# Altium schematic sheet S03.SchDoc: DQLA-Q  Dual QLA Interface Board
size 381 x 254 mm; Revision: 1.1; SheetNumber: 3; SheetTotal: 3
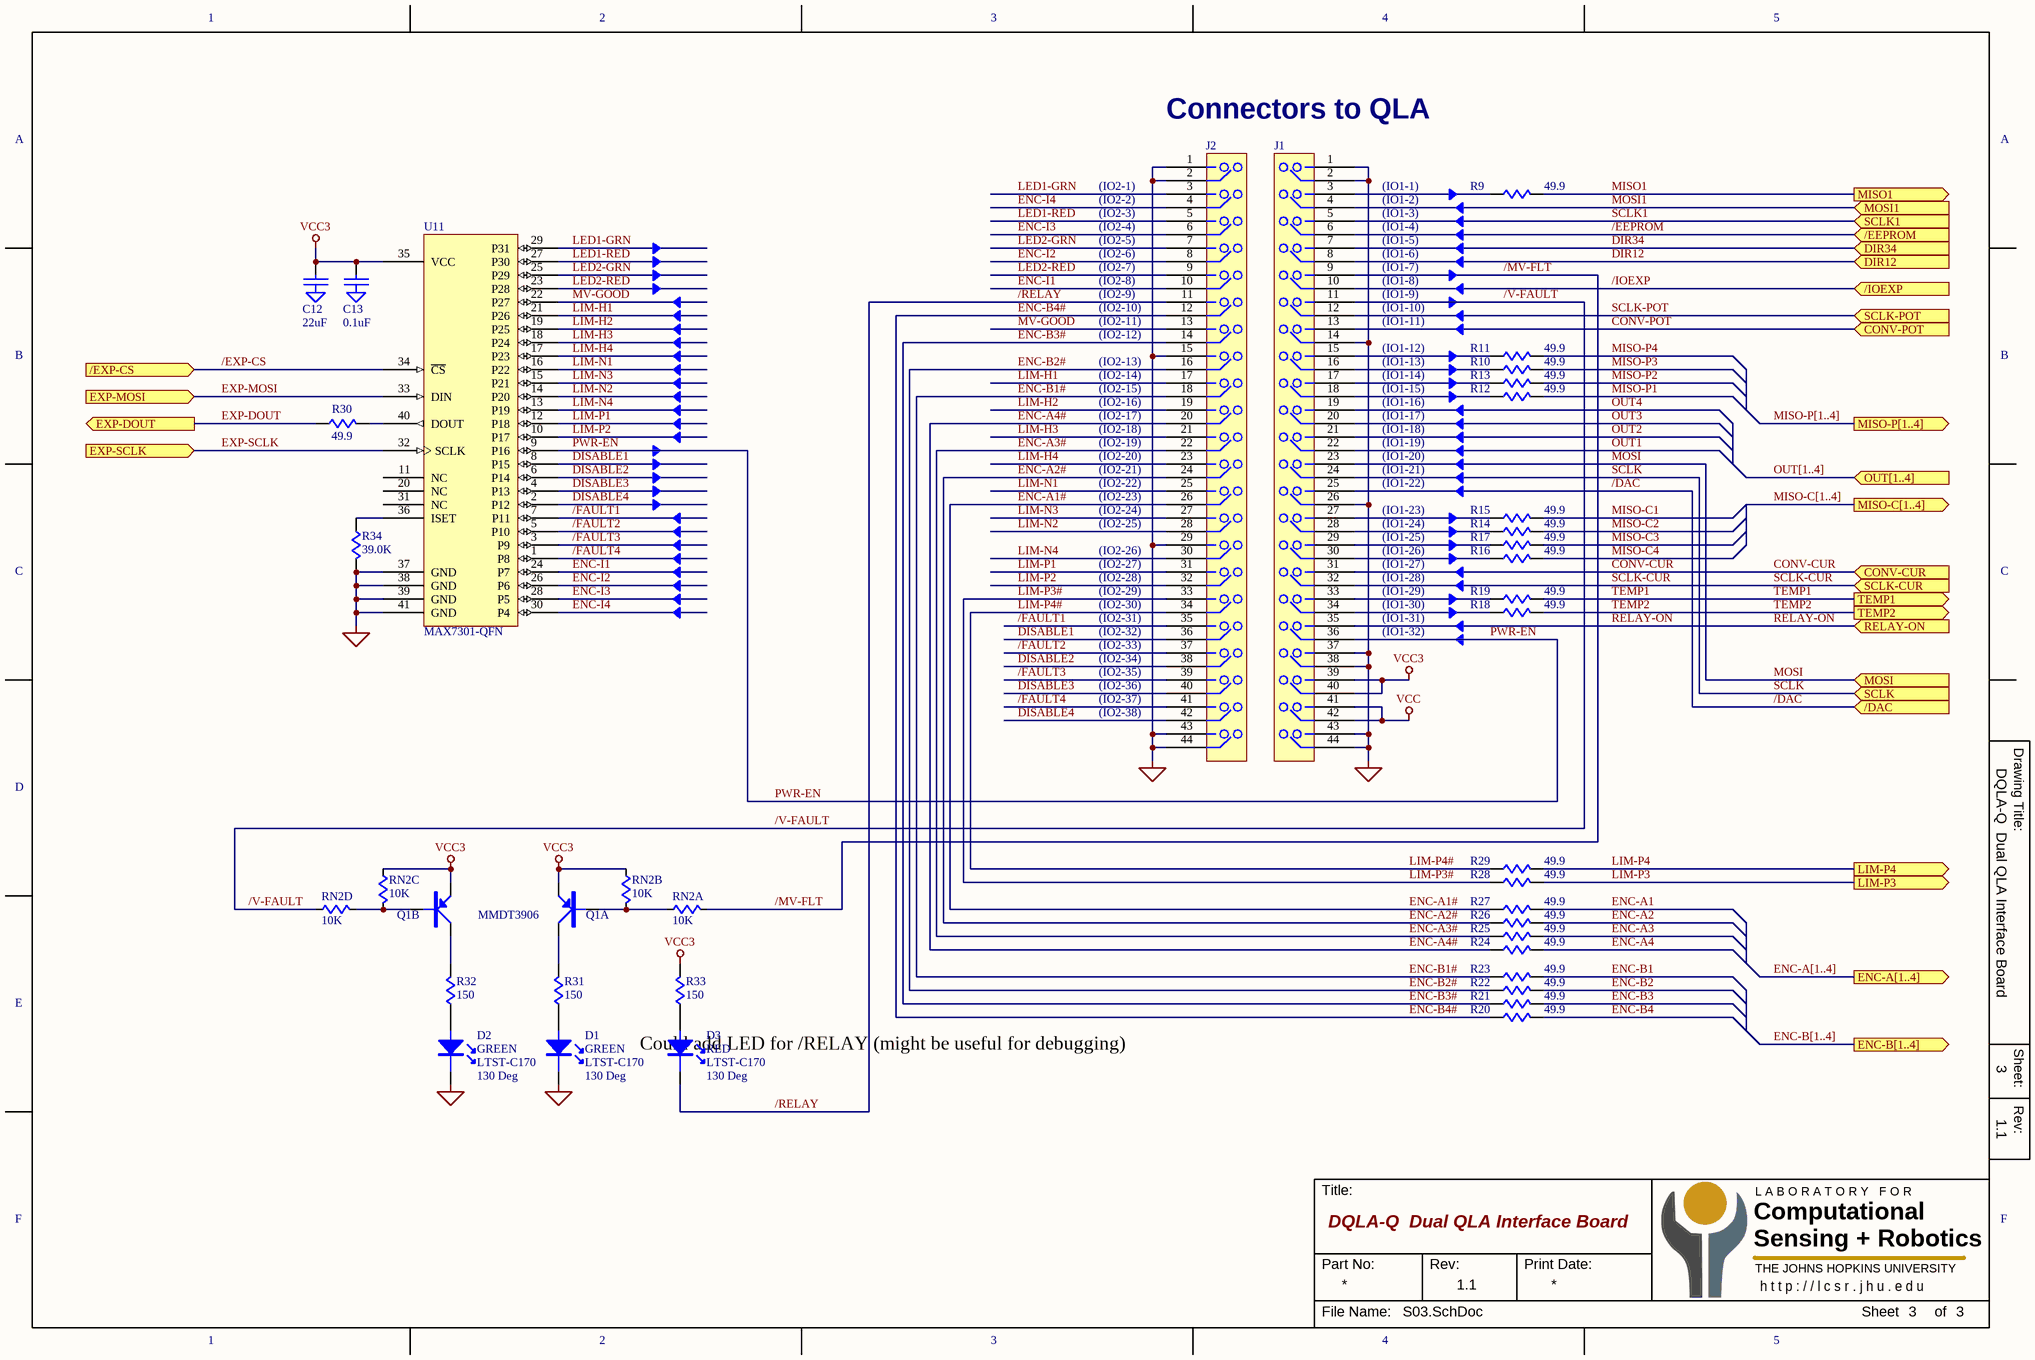
[diagram p0: S03.SchDoc]

## Parts
C12  22uF  [C0805]
C13  0.1uF  [C0402]
D1  Color: GREEN  P/N: LTST-C170  Angle: 130 Deg  [LED-0805]  (hidden comment: LED)
D2  Color: GREEN  P/N: LTST-C170  Angle: 130 Deg  [LED-0805]  (hidden comment: LED)
D3  Color: RED  P/N: LTST-C170  Angle: 130 Deg  [LED-0805]  (hidden comment: LED)
J1  HEADER 22x2-1  [HDR-22x2-2MM]  (value not drawn)
J2  HEADER 22x2-1  [HDR-22x2-2MM]  (value not drawn)
Q1  MMDT3906  [SC70-6-NP]  (parts A,B of 2)
R9  49.9  [R0402]
R10  49.9  [R0402]
R11  49.9  [R0402]
R12  49.9  [R0402]
R13  49.9  [R0402]
R14  49.9  [R0402]
R15  49.9  [R0402]
R16  49.9  [R0402]
R17  49.9  [R0402]
R18  49.9  [R0402]
R19  49.9  [R0402]
R20  49.9  [R0402]
R21  49.9  [R0402]
R22  49.9  [R0402]
R23  49.9  [R0402]
R24  49.9  [R0402]
R25  49.9  [R0402]
R26  49.9  [R0402]
R27  49.9  [R0402]
R28  49.9  [R0402]
R29  49.9  [R0402]
R30  49.9  [R0402]
R31  150  [R0603]
R32  150  [R0603]
R33  150  [R0603]
R34  39.0K  [R0402]
RN2  10K  [RN-742C083]  (parts A,B,C,D of 4)
U11  MAX7301-QFN  [QFN-40-6mm]

## Ports
/DAC (in), /EEPROM (in), /EXP-CS (in), /IOEXP (in), CONV-CUR (in), CONV-POT (in), DIR12 (in), DIR34 (in), ENC-A[1..4] (out), ENC-B[1..4] (out), EXP-DOUT (out), EXP-MOSI (in), EXP-SCLK (in), LIM-P3 (out), LIM-P4 (out), MISO1 (out), MISO-C[1..4] (out), MISO-P[1..4] (out), MOSI1 (in), MOSI (in), OUT[1..4] (in), RELAY-ON (in), SCLK1 (in), SCLK (in), SCLK-CUR (in), SCLK-POT (in), TEMP1 (out), TEMP2 (out)

## Nets
GND: C12.2(GND) C13.2(GND) D1.1(C) D2.1(C) J1.1 J1.2 J1.14 J1.26 J1.37 J1.38 J1.43 J1.44 J2.1 J2.2 J2.15 J2.29 J2.43 J2.44 R34.2 U11.37(GND) U11.38(GND) U11.39(GND) U11.41(GND)
VCC: J1.41 J1.42
VCC3: C12.1 C13.1 J1.39 J1.40 Q1.1(E) Q1.4(E) R33.2 RN2.2 RN2.3 U11.35(VCC)
/DAC: J1.25 ; port /DAC
/EEPROM: J1.6 ; port /EEPROM
/EXP-CS: U11.34(~{CS}) ; port /EXP-CS
/FAULT1: J2.35 U11.7(P11)
/FAULT2: J2.37 U11.5(P10)
/FAULT3: J2.39 U11.3(P9)
/FAULT4: J2.41 U11.1(P8)
/IOEXP: J1.10 ; port /IOEXP
/MV-FLT: J1.9 RN2.1
/RELAY: D3.1(C) J2.11
/V-FAULT: J1.11 RN2.4
CONV-CUR: J1.31 ; port CONV-CUR
CONV-POT: J1.13 ; port CONV-POT
DIR12: J1.8 ; port DIR12
DIR34: J1.7 ; port DIR34
DISABLE1: J2.36 U11.8(P15)
DISABLE2: J2.38 U11.6(P14)
DISABLE3: J2.40 U11.4(P13)
DISABLE4: J2.42 U11.2(P12)
ENC-A1: R27.2
ENC-A1#: J2.26 R27.1
ENC-A2: R26.2
ENC-A2#: J2.24 R26.1
ENC-A3: R25.2
ENC-A3#: J2.22 R25.1
ENC-A4: R24.2
ENC-A4#: J2.20 R24.1
ENC-B1: R23.2
ENC-B1#: J2.18 R23.1
ENC-B2: R22.2
ENC-B2#: J2.16 R22.1
ENC-B3: R21.2
ENC-B3#: J2.14 R21.1
ENC-B4: R20.2
ENC-B4#: J2.12 R20.1
ENC-I1: J2.10 U11.24(P7)
ENC-I2: J2.8 U11.26(P6)
ENC-I3: J2.6 U11.28(P5)
ENC-I4: J2.4 U11.30(P4)
EXP-DOUT: R30.1 ; port EXP-DOUT
EXP-MOSI: U11.33(DIN) ; port EXP-MOSI
EXP-SCLK: U11.32(SCLK) ; port EXP-SCLK
LED1-GRN: J2.3 U11.29(P31)
LED1-RED: J2.5 U11.27(P30)
LED2-GRN: J2.7 U11.25(P29)
LED2-RED: J2.9 U11.23(P28)
LIM-H1: J2.17 U11.21(P26)
LIM-H2: J2.19 U11.19(P25)
LIM-H3: J2.21 U11.18(P24)
LIM-H4: J2.23 U11.17(P23)
LIM-N1: J2.25 U11.16(P22)
LIM-N2: J2.28 U11.14(P20)
LIM-N3: J2.27 U11.15(P21)
LIM-N4: J2.30 U11.13(P19)
LIM-P1: J2.31 U11.12(P18)
LIM-P2: J2.32 U11.10(P17)
LIM-P3: R28.2 ; port LIM-P3
LIM-P3#: J2.33 R28.1
LIM-P4: R29.2 ; port LIM-P4
LIM-P4#: J2.34 R29.1
MISO1: R9.2 ; port MISO1
MISO-C1: R15.2
MISO-C2: R14.2
MISO-C3: R17.2
MISO-C4: R16.2
MISO-P1: R12.2
MISO-P2: R13.2
MISO-P3: R10.2
MISO-P4: R11.2
MOSI: J1.23 ; port MOSI
MOSI1: J1.4 ; port MOSI1
MV-GOOD: J2.13 U11.22(P27)
OUT1: J1.22
OUT2: J1.21
OUT3: J1.20
OUT4: J1.19
PWR-EN: J1.36 U11.9(P16)
RELAY-ON: J1.35 ; port RELAY-ON
SCLK: J1.24 ; port SCLK
SCLK1: J1.5 ; port SCLK1
SCLK-CUR: J1.32 ; port SCLK-CUR
SCLK-POT: J1.12 ; port SCLK-POT
TEMP1: R19.2 ; port TEMP1
TEMP2: R18.2 ; port TEMP2
NetD1_2: D1.2(A) R31.1
NetD2_2: D2.2(A) R32.1
NetD3_2: D3.2(A) R33.1
NetJ1_3: J1.3 R9.1
NetJ1_15: J1.15 R11.1
NetJ1_16: J1.16 R10.1
NetJ1_17: J1.17 R13.1
NetJ1_18: J1.18 R12.1
NetJ1_27: J1.27 R15.1
NetJ1_28: J1.28 R14.1
NetJ1_29: J1.29 R17.1
NetJ1_30: J1.30 R16.1
NetJ1_33: J1.33 R19.1
NetJ1_34: J1.34 R18.1
NetQ1_2: Q1.2(B) RN2.7 RN2.8
NetQ1_3: Q1.3(C) R32.2
NetQ1_5: Q1.5(B) RN2.5 RN2.6
NetQ1_6: Q1.6(C) R31.2
NetR30_2: R30.2 U11.40(DOUT)
NetR34_1: R34.1 U11.36(ISET)

Not connected (* = marked no-connect by the designer): U11 11(NC) 20(NC) 31(NC)

## Buses and harness runs
bus ENC-A[1..4] = port ENC-A[1..4]
bus ENC-B[1..4] = port ENC-B[1..4]
bus MISO-C[1..4] = port MISO-C[1..4]
bus MISO-P[1..4] = port MISO-P[1..4]
bus OUT[1..4] = port OUT[1..4]

## Notes on the sheet
- Connectors to QLA
- (IO2-1)
- (IO2-2)
- (IO2-3)
- (IO2-4)
- (IO1-1)
- (IO1-2)
- (IO1-3)
- (IO1-4)
- (IO2-5)
- (IO2-6)
- (IO2-7)
- (IO2-8)
- (IO2-9)
- (IO1-5)
- (IO1-6)
- (IO1-7)
- (IO1-8)
- (IO1-9)
- (IO2-10)
- (IO2-11)
- (IO2-12)
- (IO2-13)
- (IO1-10)
- (IO1-11)
- (IO1-12)
- (IO1-13)
- (IO2-14)
- (IO2-15)
- (IO2-16)
- (IO2-17)
- (IO2-18)
- (IO1-14)
- (IO1-15)
- (IO1-16)
- (IO1-17)
- (IO1-18)
- (IO2-19)
- (IO2-20)
- (IO2-21)
- (IO2-22)
- (IO2-23)
- (IO1-19)
- (IO1-20)
- (IO1-21)
- (IO1-22)
- (IO2-24)
- (IO2-25)
- (IO2-26)
- (IO2-27)
- (IO1-23)
- (IO1-24)
- (IO1-25)
- (IO1-26)
- (IO1-27)
- (IO2-28)
- (IO2-29)
- (IO2-30)
- (IO2-31)
- (IO2-32)
- (IO1-28)
- (IO1-29)
- (IO1-30)
- (IO1-31)
- (IO1-32)
- (IO2-33)
- (IO2-34)
- (IO2-35)
- (IO2-36)
- (IO2-37)
- (IO2-38)
- Could add LED for /RELAY (might be useful for debugging)
- (near D3) Could add LED for /RELAY (might be useful for debugging)
- 1
- 2
- 3
- 4
- 5
- A
- B
- C
- Drawing Title:
- D
- E
- Sheet:
- Rev:
- F
- Title:
- Computational
- Sensing + Robotics
- L A B O R A T O R Y   F O R
- Part No:
- Print Date:
- THE JOHNS HOPKINS UNIVERSITY
- h t t p : / / l c s r . j h u . e d u
- File Name:
- Sheet
- of

## Library data of the parts
C12 C13 = CAP-GND
Q1 = PNP-DUAL-DIAG
R9-R34 = R
RN2 = RN-DISC-SM-4X